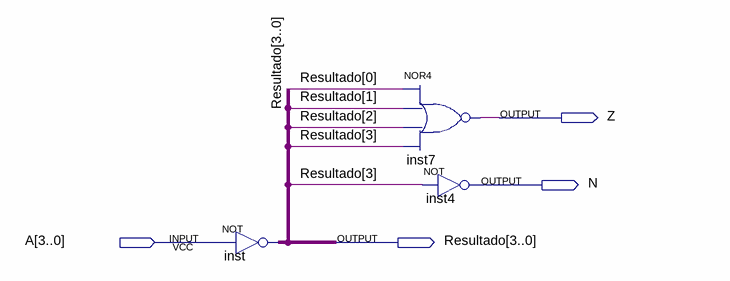
[diagram p0: schematic sheet]
// Quartus schematic notA.bdf as structural Verilog: 3 symbols, 4 pins
module notA (
  input  [3:0] A,
  output Z,
  output N,
  output [3:0] Resultado
);

  assign Resultado = ~A;  // NOT inst, 4 bits wide
  nor inst7 (Z, Resultado[0], Resultado[1], Resultado[2], Resultado[3]);
  not inst4 (N, Resultado[3]);
endmodule
